# Altium schematic sheet MGNGSQ4_DC_Loopback.SchDoc
size A
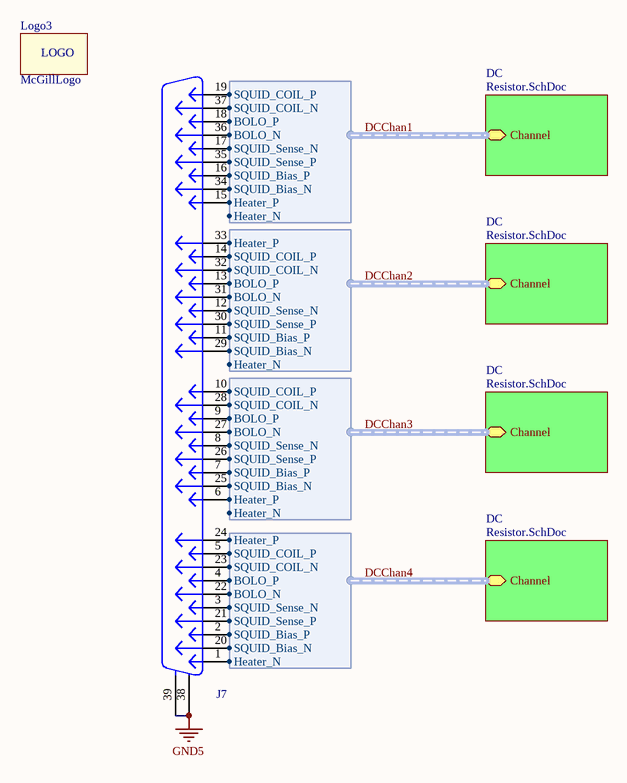
[diagram p0: MGNGSQ4_DC_Loopback.SchDoc]

## Parts
J7  DB37M  [DSUB37-M]  (value not drawn)
Logo3  McGillLogo  [McGillLogo1]  (no BOM)

## Sub-sheets
DC = Resistor.SchDoc: Channel (harness SQUID_CH_IN)
DC = Resistor.SchDoc: Channel (harness SQUID_CH_IN)
DC = Resistor.SchDoc: Channel (harness SQUID_CH_IN)
DC = Resistor.SchDoc: Channel (harness SQUID_CH_IN)

## Harnesses
SQUID_CH_IN: SQUID_COIL_P, SQUID_COIL_N, BOLO_P, BOLO_N, SQUID_Sense_P, SQUID_Bias_P, SQUID_Bias_N, Heater_P, SQUID_Sense_N, Heater_N

## Nets
GND5: J7.38(MH1) J7.39(MH2)
DCChan1.BOLO_N: J7.36 ; sheet DC/Channel.BOLO_N
DCChan1.BOLO_P: J7.18 ; sheet DC/Channel.BOLO_P
DCChan1.Heater_P: J7.15 ; sheet DC/Channel.Heater_P
DCChan1.SQUID_Bias_N: J7.34 ; sheet DC/Channel.SQUID_Bias_N
DCChan1.SQUID_Bias_P: J7.16 ; sheet DC/Channel.SQUID_Bias_P
DCChan1.SQUID_COIL_N: J7.37 ; sheet DC/Channel.SQUID_COIL_N
DCChan1.SQUID_COIL_P: J7.19 ; sheet DC/Channel.SQUID_COIL_P
DCChan1.SQUID_Sense_N: J7.17 ; sheet DC/Channel.SQUID_Sense_N
DCChan1.SQUID_Sense_P: J7.35 ; sheet DC/Channel.SQUID_Sense_P
DCChan2.BOLO_N: J7.31 ; sheet DC/Channel.BOLO_N
DCChan2.BOLO_P: J7.13 ; sheet DC/Channel.BOLO_P
DCChan2.Heater_P: J7.33 ; sheet DC/Channel.Heater_P
DCChan2.SQUID_Bias_N: J7.29 ; sheet DC/Channel.SQUID_Bias_N
DCChan2.SQUID_Bias_P: J7.11 ; sheet DC/Channel.SQUID_Bias_P
DCChan2.SQUID_COIL_N: J7.32 ; sheet DC/Channel.SQUID_COIL_N
DCChan2.SQUID_COIL_P: J7.14 ; sheet DC/Channel.SQUID_COIL_P
DCChan2.SQUID_Sense_N: J7.12 ; sheet DC/Channel.SQUID_Sense_N
DCChan2.SQUID_Sense_P: J7.30 ; sheet DC/Channel.SQUID_Sense_P
DCChan3.BOLO_N: J7.27 ; sheet DC/Channel.BOLO_N
DCChan3.BOLO_P: J7.9 ; sheet DC/Channel.BOLO_P
DCChan3.Heater_P: J7.6 ; sheet DC/Channel.Heater_P
DCChan3.SQUID_Bias_N: J7.25 ; sheet DC/Channel.SQUID_Bias_N
DCChan3.SQUID_Bias_P: J7.7 ; sheet DC/Channel.SQUID_Bias_P
DCChan3.SQUID_COIL_N: J7.28 ; sheet DC/Channel.SQUID_COIL_N
DCChan3.SQUID_COIL_P: J7.10 ; sheet DC/Channel.SQUID_COIL_P
DCChan3.SQUID_Sense_N: J7.8 ; sheet DC/Channel.SQUID_Sense_N
DCChan3.SQUID_Sense_P: J7.26 ; sheet DC/Channel.SQUID_Sense_P
DCChan4.BOLO_N: J7.22 ; sheet DC/Channel.BOLO_N
DCChan4.BOLO_P: J7.4 ; sheet DC/Channel.BOLO_P
DCChan4.Heater_N: J7.1 ; sheet DC/Channel.Heater_N
DCChan4.Heater_P: J7.24 ; sheet DC/Channel.Heater_P
DCChan4.SQUID_Bias_N: J7.20 ; sheet DC/Channel.SQUID_Bias_N
DCChan4.SQUID_Bias_P: J7.2 ; sheet DC/Channel.SQUID_Bias_P
DCChan4.SQUID_COIL_N: J7.23 ; sheet DC/Channel.SQUID_COIL_N
DCChan4.SQUID_COIL_P: J7.5 ; sheet DC/Channel.SQUID_COIL_P
DCChan4.SQUID_Sense_N: J7.3 ; sheet DC/Channel.SQUID_Sense_N
DCChan4.SQUID_Sense_P: J7.21 ; sheet DC/Channel.SQUID_Sense_P

## Buses and harness runs
harness DCChan1 = sheet DC/Channel
harness DCChan2 = sheet DC/Channel
harness DCChan3 = sheet DC/Channel
harness DCChan4 = sheet DC/Channel

## Notes on the sheet
- (in symbol Logo) LOGO

## Library data of the parts
J7 = DB37M: Manufacturer: Norcomp; Part Constraints: 182-037-113R531; Assembly Comments: none; Cost: $4.32; Manufacturer Part Number: 182-037-113R531; Supplier: Digikey; Supplier Part Number: 182-37ME-ND; Value: DB37M; Type: thru-hole
Logo3 = Logo: Silkscreen Logo; Manufacturer: McGill; Assembly Comments: none; Value: McGillLogo; Cost: $0; Type: SMD